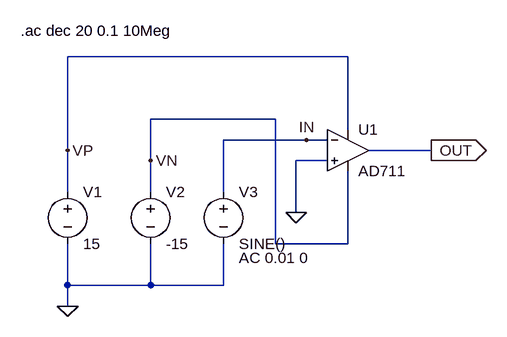
[diagram p0: schematic 増幅_.asc]
増幅_.asc, the LTspice schematic file:
Version 4
SHEET 1 880 680
WIRE 352 96 -80 96
WIRE 240 192 48 192
WIRE 352 208 352 96
WIRE 288 224 160 224
WIRE 320 224 288 224
WIRE -80 240 -80 96
WIRE 480 240 384 240
WIRE 48 256 48 192
WIRE 320 256 272 256
WIRE -80 304 -80 240
WIRE 48 304 48 256
WIRE 160 304 160 224
WIRE 272 336 272 256
WIRE 240 384 240 192
WIRE 352 384 352 272
WIRE 352 384 240 384
WIRE -80 448 -80 384
WIRE 48 448 48 384
WIRE 48 448 -80 448
WIRE 160 448 160 384
WIRE 160 448 48 448
WIRE -80 480 -80 448
FLAG -80 480 0
FLAG 272 336 0
FLAG 480 240 OUT
IOPIN 480 240 Out
FLAG -80 240 VP
FLAG 48 256 VN
FLAG 288 224 IN
SYMBOL OpAmps/AD711 352 176 R0
SYMATTR InstName U1
SYMBOL voltage -80 288 R0
SYMATTR InstName V1
SYMATTR Value 15
SYMBOL voltage 48 288 R0
SYMATTR InstName V2
SYMATTR Value -15
SYMBOL voltage 160 288 R0
WINDOW 123 24 118 Left 2
SYMATTR InstName V3
SYMATTR Value SINE()
SYMATTR Value2 AC 0.01 0
TEXT -152 56 Left 2 !.ac dec 20 0.1 10Meg

The netlist it stands for:
* 増幅_.asc
XU1 0 IN VP VN OUT AD712  ; AD711, pins In+ In- V+ V- OUT
V1 VP 0 15
V2 VN 0 -15
V3 IN 0 SINE() AC 0.01 0
.ac dec 20 0.1 10Meg
.lib ADI1.lib
.backanno
.end